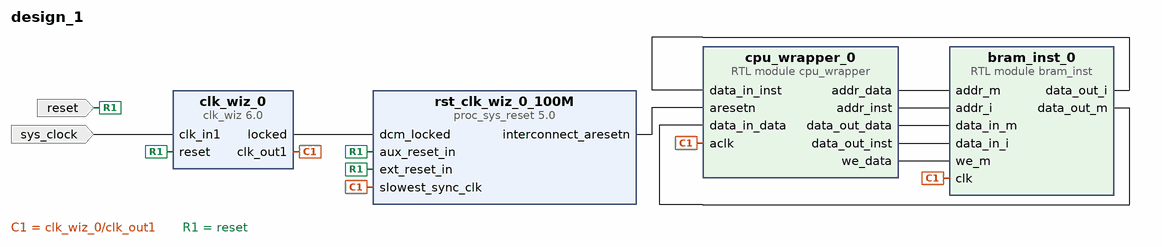
[diagram p0: block diagram of the top level]
# Vivado block design design_1, xc7a35tcpg236-1, Vivado 2023.2
create_bd_design design_1

create_bd_port -dir I -type clk sys_clock
set_property -dict {CONFIG.ASSOCIATED_RESET reset CONFIG.FREQ_HZ 100000000 CONFIG.PHASE 0.0} [get_bd_ports sys_clock]
create_bd_port -dir I -type rst reset
set_property -dict {CONFIG.POLARITY ACTIVE_HIGH} [get_bd_ports reset]

create_bd_cell -type ip -vlnv xilinx.com:ip:clk_wiz:6.0 clk_wiz_0
set_property -dict [list \
  CONFIG.CLK_IN1_BOARD_INTERFACE sys_clock \
  CONFIG.ENABLE_CLOCK_MONITOR false \
  CONFIG.PRIMITIVE MMCM \
  CONFIG.RESET_BOARD_INTERFACE reset \
  CONFIG.RESET_PORT reset \
  CONFIG.RESET_TYPE ACTIVE_HIGH \
  CONFIG.USE_BOARD_FLOW true \
] [get_bd_cells clk_wiz_0]
create_bd_cell -type ip -vlnv xilinx.com:ip:proc_sys_reset:5.0 rst_clk_wiz_0_100M
set_property -dict {CONFIG.C_AUX_RST_WIDTH 4 CONFIG.C_EXT_RST_WIDTH 4 CONFIG.C_NUM_BUS_RST 1} [get_bd_cells rst_clk_wiz_0_100M]
create_bd_cell -type module -reference cpu_wrapper cpu_wrapper_0
create_bd_cell -type module -reference bram_inst bram_inst_0

# ---- connections ----

connect_bd_net [get_bd_pins bram_inst_0/data_out_i] [get_bd_pins cpu_wrapper_0/data_in_inst]
connect_bd_net [get_bd_pins bram_inst_0/data_out_m] [get_bd_pins cpu_wrapper_0/data_in_data]
connect_bd_net [get_bd_pins clk_wiz_0/clk_out1] \
  [get_bd_pins rst_clk_wiz_0_100M/slowest_sync_clk] [get_bd_pins cpu_wrapper_0/aclk] [get_bd_pins bram_inst_0/clk]
connect_bd_net [get_bd_pins clk_wiz_0/locked] [get_bd_pins rst_clk_wiz_0_100M/dcm_locked]
connect_bd_net [get_bd_pins cpu_wrapper_0/addr_data] [get_bd_pins bram_inst_0/addr_m]
connect_bd_net [get_bd_pins cpu_wrapper_0/addr_inst] [get_bd_pins bram_inst_0/addr_i]
connect_bd_net [get_bd_pins cpu_wrapper_0/data_out_data] [get_bd_pins bram_inst_0/data_in_m]
connect_bd_net [get_bd_pins cpu_wrapper_0/data_out_inst] [get_bd_pins bram_inst_0/data_in_i]
connect_bd_net [get_bd_pins cpu_wrapper_0/we_data] [get_bd_pins bram_inst_0/we_m]
connect_bd_net [get_bd_ports reset] \
  [get_bd_pins rst_clk_wiz_0_100M/ext_reset_in] [get_bd_pins clk_wiz_0/reset] [get_bd_pins rst_clk_wiz_0_100M/aux_reset_in]
connect_bd_net [get_bd_pins rst_clk_wiz_0_100M/interconnect_aresetn] [get_bd_pins cpu_wrapper_0/aresetn]
connect_bd_net [get_bd_ports sys_clock] [get_bd_pins clk_wiz_0/clk_in1]

validate_bd_design
save_bd_design
